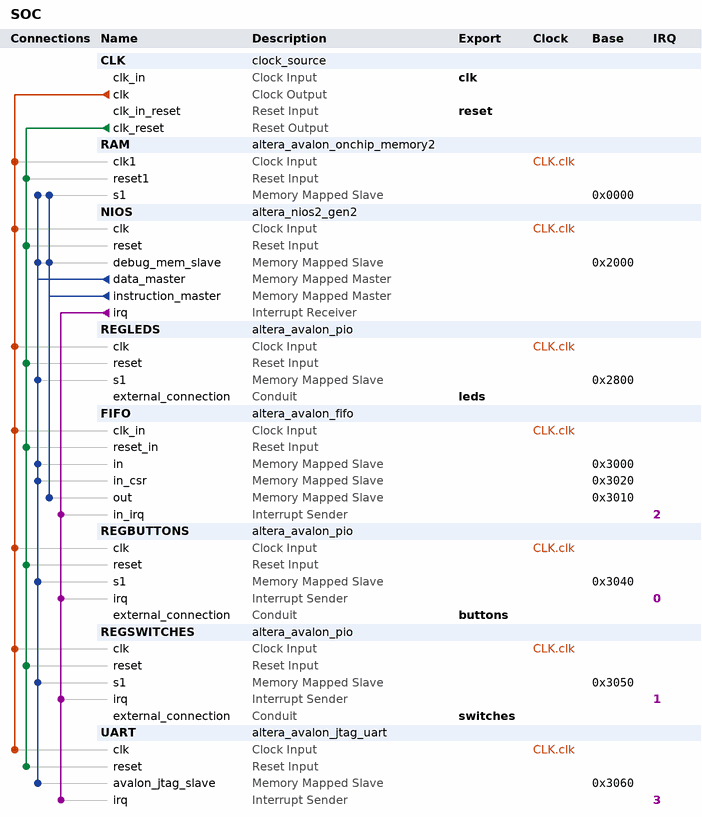
[diagram p0: system contents]
# Platform Designer (Qsys) system SOC, Cyclone V 5CSEMA5F31C6
# Parameters at their usual value, and those the tool derives, are not listed.
package require -exact qsys 18.1
create_system SOC
set_project_property DEVICE_FAMILY {Cyclone V}
set_project_property DEVICE 5CSEMA5F31C6

add_instance CLK clock_source 18.1
set_instance_parameter_value CLK clockFrequency 50000000

add_instance RAM altera_avalon_onchip_memory2 18.1
set_instance_parameter_value RAM dataWidth 32
set_instance_parameter_value RAM dualPort false
set_instance_parameter_value RAM initMemContent true
set_instance_parameter_value RAM initializationFileName onchip_mem.hex
set_instance_parameter_value RAM memorySize 8192

add_instance NIOS altera_nios2_gen2 18.1
set_instance_parameter_value NIOS dcache_size 2048
set_instance_parameter_value NIOS exceptionSlave RAM.s1
set_instance_parameter_value NIOS icache_size 4096
set_instance_parameter_value NIOS impl Tiny
set_instance_parameter_value NIOS resetSlave RAM.s1

add_instance REGLEDS altera_avalon_pio 18.1
set_instance_parameter_value REGLEDS direction Output
set_instance_parameter_value REGLEDS width 32

add_instance FIFO altera_avalon_fifo 18.1
set_instance_parameter_value FIFO bitsPerSymbol 16
set_instance_parameter_value FIFO channelWidth 8
set_instance_parameter_value FIFO errorWidth 8
set_instance_parameter_value FIFO fifoDepth 1024
set_instance_parameter_value FIFO fifoInputInterfaceOptions AVALONMM_WRITE
set_instance_parameter_value FIFO fifoOutputInterfaceOptions AVALONMM_READ
set_instance_parameter_value FIFO singleClockMode true
set_instance_parameter_value FIFO symbolsPerBeat 2
set_instance_parameter_value FIFO useIRQ true
set_instance_parameter_value FIFO usePacket true
set_instance_parameter_value FIFO useReadControl false

add_instance REGBUTTONS altera_avalon_pio 18.1
set_instance_parameter_value REGBUTTONS captureEdge true
set_instance_parameter_value REGBUTTONS direction Input
set_instance_parameter_value REGBUTTONS generateIRQ true
set_instance_parameter_value REGBUTTONS irqType EDGE
set_instance_parameter_value REGBUTTONS simDoTestBenchWiring true
set_instance_parameter_value REGBUTTONS width 4

add_instance REGSWITCHES altera_avalon_pio 18.1
set_instance_parameter_value REGSWITCHES captureEdge true
set_instance_parameter_value REGSWITCHES direction Input
set_instance_parameter_value REGSWITCHES generateIRQ true
set_instance_parameter_value REGSWITCHES irqType EDGE
set_instance_parameter_value REGSWITCHES simDoTestBenchWiring true
set_instance_parameter_value REGSWITCHES width 4

add_instance UART altera_avalon_jtag_uart 18.1
set_instance_parameter_value UART simInteractiveOptions NO_INTERACTIVE_WINDOWS

# connections
add_connection CLK.clk FIFO.clk_in clock
add_connection CLK.clk NIOS.clk clock
add_connection CLK.clk RAM.clk1 clock
add_connection CLK.clk REGBUTTONS.clk clock
add_connection CLK.clk REGLEDS.clk clock
add_connection CLK.clk REGSWITCHES.clk clock
add_connection CLK.clk UART.clk clock
add_connection CLK.clk_reset FIFO.reset_in reset
add_connection CLK.clk_reset NIOS.reset reset
add_connection CLK.clk_reset RAM.reset1 reset
add_connection CLK.clk_reset REGBUTTONS.reset reset
add_connection CLK.clk_reset REGLEDS.reset reset
add_connection CLK.clk_reset REGSWITCHES.reset reset
add_connection CLK.clk_reset UART.reset reset
add_connection NIOS.data_master FIFO.in avalon
set_connection_parameter_value NIOS.data_master/FIFO.in baseAddress 0x3000
add_connection NIOS.data_master FIFO.in_csr avalon
set_connection_parameter_value NIOS.data_master/FIFO.in_csr baseAddress 0x3020
add_connection NIOS.data_master NIOS.debug_mem_slave avalon
set_connection_parameter_value NIOS.data_master/NIOS.debug_mem_slave baseAddress 0x2000
add_connection NIOS.data_master RAM.s1 avalon
set_connection_parameter_value NIOS.data_master/RAM.s1 baseAddress 0x0000
add_connection NIOS.data_master REGBUTTONS.s1 avalon
set_connection_parameter_value NIOS.data_master/REGBUTTONS.s1 baseAddress 0x3040
add_connection NIOS.data_master REGLEDS.s1 avalon
set_connection_parameter_value NIOS.data_master/REGLEDS.s1 baseAddress 0x2800
add_connection NIOS.data_master REGSWITCHES.s1 avalon
set_connection_parameter_value NIOS.data_master/REGSWITCHES.s1 baseAddress 0x3050
add_connection NIOS.data_master UART.avalon_jtag_slave avalon
set_connection_parameter_value NIOS.data_master/UART.avalon_jtag_slave baseAddress 0x3060
add_connection NIOS.instruction_master FIFO.out avalon
set_connection_parameter_value NIOS.instruction_master/FIFO.out baseAddress 0x3010
add_connection NIOS.instruction_master NIOS.debug_mem_slave avalon
set_connection_parameter_value NIOS.instruction_master/NIOS.debug_mem_slave baseAddress 0x2000
add_connection NIOS.instruction_master RAM.s1 avalon
set_connection_parameter_value NIOS.instruction_master/RAM.s1 baseAddress 0x0000
add_connection NIOS.irq FIFO.in_irq interrupt
set_connection_parameter_value NIOS.irq/FIFO.in_irq irqNumber 2
add_connection NIOS.irq REGBUTTONS.irq interrupt
set_connection_parameter_value NIOS.irq/REGBUTTONS.irq irqNumber 0
add_connection NIOS.irq REGSWITCHES.irq interrupt
set_connection_parameter_value NIOS.irq/REGSWITCHES.irq irqNumber 1
add_connection NIOS.irq UART.irq interrupt
set_connection_parameter_value NIOS.irq/UART.irq irqNumber 3

# exported interfaces
add_interface buttons conduit end
set_interface_property buttons EXPORT_OF REGBUTTONS.external_connection
add_interface clk clock sink
set_interface_property clk EXPORT_OF CLK.clk_in
add_interface leds conduit end
set_interface_property leds EXPORT_OF REGLEDS.external_connection
add_interface reset reset sink
set_interface_property reset EXPORT_OF CLK.clk_in_reset
add_interface switches conduit end
set_interface_property switches EXPORT_OF REGSWITCHES.external_connection

set_interconnect_requirement {$system} qsys_mm.clockCrossingAdapter HANDSHAKE
set_interconnect_requirement {$system} qsys_mm.enableEccProtection FALSE
set_interconnect_requirement {$system} qsys_mm.insertDefaultSlave FALSE
set_interconnect_requirement {$system} qsys_mm.maxAdditionalLatency 1

save_system SOC.qsys
